# Altium schematic sheet Side PCB.SchDoc
size A4
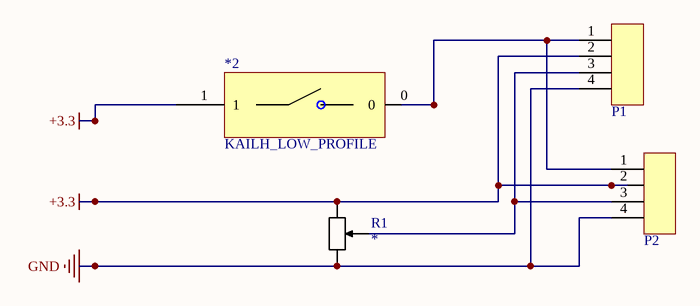
[diagram p0: Side PCB.SchDoc]

## Parts
*2  KAILH_LOW_PROFILE  [KAILH_LOW_PROFILE]
P1  JST_SE_4PIN  [JST_SE_4PIN]  (value not drawn)
P2  JST_SE_4PIN  [JST_SE_4PIN]  (value not drawn)
R1  R_POTMETER  (value not drawn)

## Nets
+3.3: *2.1 P1.2 P2.2 R1.1
GND: P1.4 P2.4 R1.2
Net*2_0: *2.0 P1.1 P2.1
NetP1_3: P1.3 P2.3

## Library data of the parts
P1 P2 = JST_SE_4PIN: Supplier Link 1: *; Supplier Part Number 1: *
R1 = R_POTMETER: Supplier 1: *; Supplier Part Number 1: *; Value: *